# EasyEDA schematic SCH_TempMate_1.json
TITLE: Sheet_2; REV: 1.0; Date: 2025-06-21; Sheet: 1/1; Drawn By: duleni_w; Company: Your Company
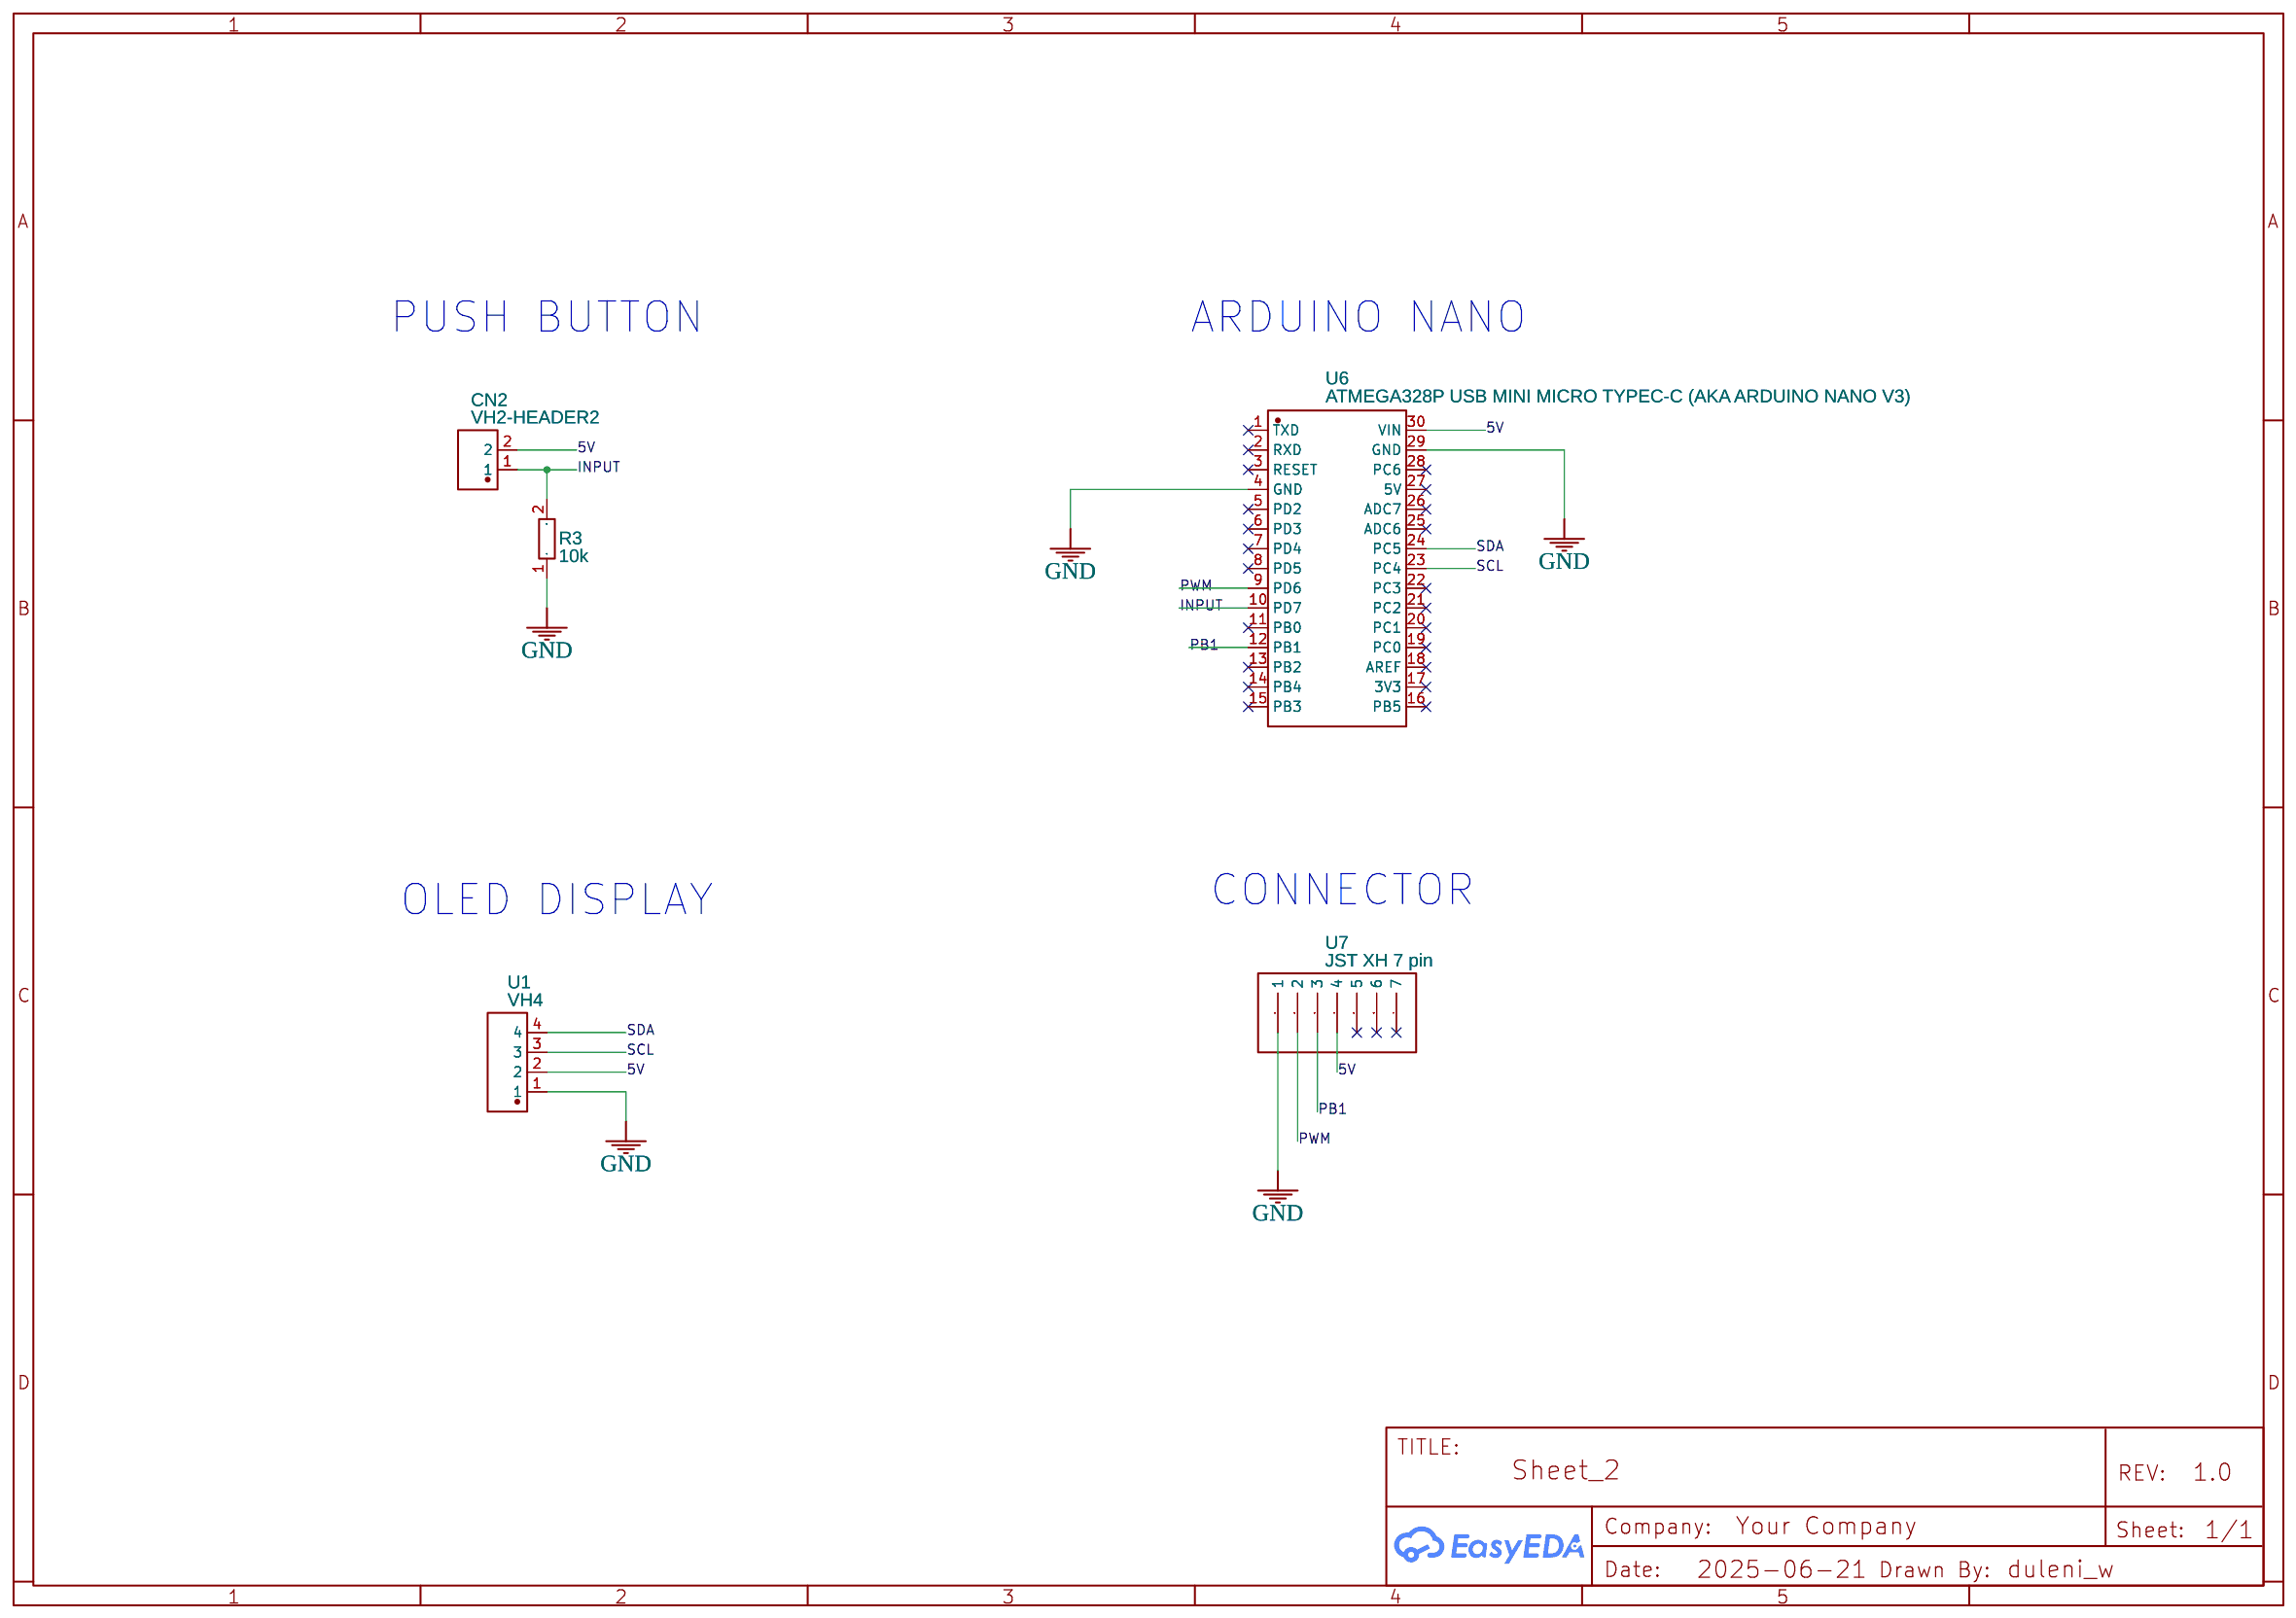
[diagram p0: schematic sheet]

## Parts
CN2  VH2-HEADER2  [CONN-TH_2P-P4.00_VH2-HEADER2]
R3  10k  [XOHM-THROUGH-HOLE-RESISTORS-5%-1/4W-D2.3-L6.5MM-FP]
U1  VH4  [CONN-TH_4P-P3.96_B4P-VH]
U6  ATMEGA328P USB MINI MICRO TYPEC-C (AKA ARDUINO NANO V3)  [COMM-TH_L43.2-W17.8-P2.54_ATMEGA328P]
U7  JST XH 7 pin  [JST XH 7]

## Library data of the parts
CN2 = VH2-HEADER2: Contributor: LCSC; Supplier: LCSC; Supplier Part: C9900011009; Manufacturer: null; Manufacturer Part: VH2-Header2; JLCPCB Part Class: Extended Part
R3 = XOHM-THROUGH-HOLE-RESISTORS-5%-1/4W-D2.3-L6.5MM: Contributor: Yousef.Hossam851; Supplier: LCSC; Supplier Part: C119313; Manufacturer: CCO(千志电子); Manufacturer Part: MF1/4W-330Ω±1% T; JLCPCB Part Class: Extended Part
U1 = VH4: Contributor: lcsc; Supplier: LCSC; Supplier Part: C9900011000; Manufacturer: null; JLCPCB Part Class: Extended Part
U6 = ATMEGA328P USB MINI MICRO TYPEC-C (AKA ARDUINO NANO V3): Supplier: LCSC; Supplier Part: C9900187880; Manufacturer: null; Manufacturer Part: ATMEGA328P USB Mini Micro Typec-C (aka Arduino Nano V3); JLCPCB Part Class: Extended Part; Contributor: lcsc
U7 = JST XH 7 pin: Contributor: HenryPenton

## Nets
5V: CN2.2 U1.2 U6.30(VIN) U7.4
GND: R3.1 U1.1 U6.4(GND) U6.29(GND) U7.1
INPUT: CN2.1 R3.2 U6.10(PD7)
PB1: U6.12(PB1) U7.3
PWM: U6.9(PD6) U7.2
SCL: U1.3 U6.23(PC4)
SDA: U1.4 U6.24(PC5)

Not connected (* = marked no-connect by the designer): U6 1(TXD)* 2(RXD)* 3(RESET)* 5(PD2)* 6(PD3)* 7(PD4)* 8(PD5)* 11(PB0)* 13(PB2)* 14(PB4)* 15(PB3)* 16(PB5)* 17(3V3)* 18(AREF)* 19(PC0)* 20(PC1)* 21(PC2)* 22(PC3)* 25(ADC6)* 26(ADC7)* 27(5V)* 28(PC6)*; U7 5* 6* 7*

## Notes on the sheet
- PUSH BUTTON
- ARDUINO NANO
- OLED DISPLAY
- CONNECTOR
